# EAGLE design ai_breakout_ws2812 (EAGLE 6.5.0)
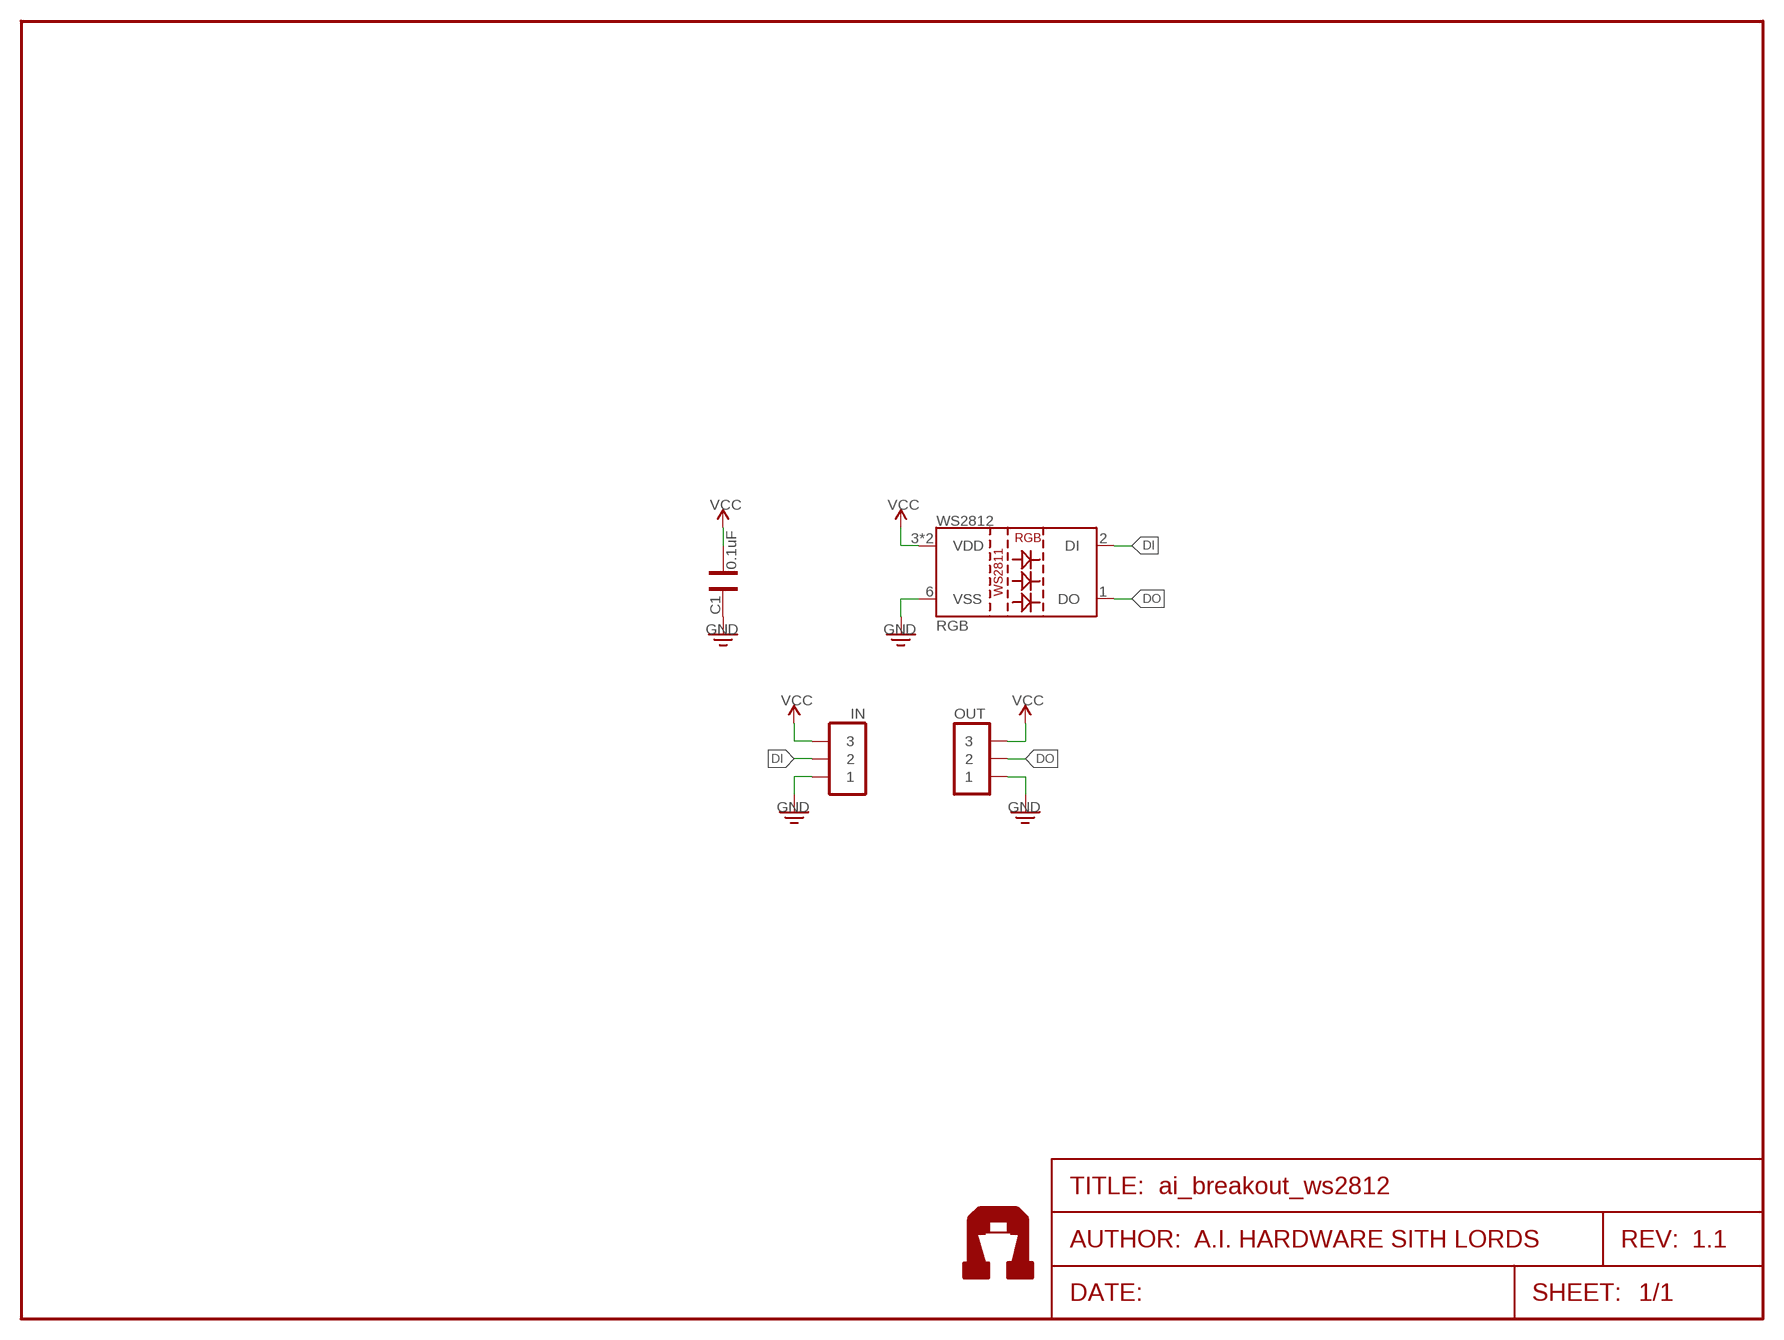
[diagram p0: schematic, sheet 1]
FRAME1 (FRAME-LETTER): AUTHOR: A.I. HARDWARE SITH LORDS; REV: 1.1

## Parts
C1  0.1uF  CAP0603  [CAP-0603]
IN  1X03  [1X03]
OUT  1X03  [1X03]
RGB  LED-WS2812  [LED-WS2812]
U$5  AI-LOGOL  [AI-LOGO-L]

## Nets
DI: IN.2 RGB.2(DI)
DO: OUT.2 RGB.1(DO)
GND: C1.2 IN.1 OUT.1 RGB.6(VSS)
VCC: C1.1 IN.3 OUT.3 RGB.3(VDD) RGB.5(VDD)

## Library data of the parts
C1 = Ai_Passives:CAP
IN OUT = Ai_Connectors:1X03
RGB = Ai_LED:LED-WS2812: WS2812 RGB LED with WS2811 driver A 5x5mm SMD LED with built-in controller IC.
U$5 = Ai_Miscellany:AI-LOGO

## Board
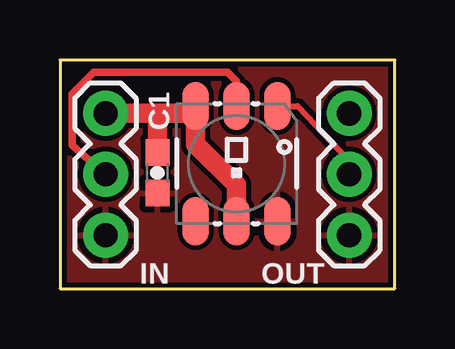
[diagram p1: board, top side]
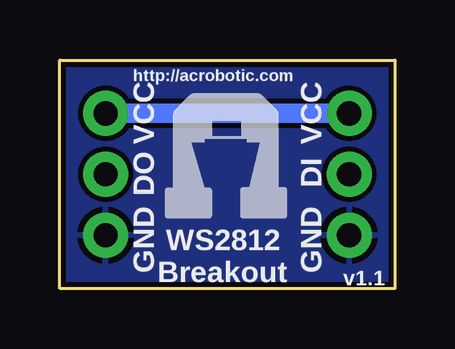
[diagram p2: board, bottom side, seen from below]

Size 13.97 x 9.53 mm. Coordinates in mm from the lower left corner, seen from the top.
Outline: 0,0 13.97,0 13.97,9.53 0,9.53 0,0
Copper layers (1*16): Top 0.035mm / dielectric 1.5mm / Bottom 0.035mm
Design rules "ai_2layer": minimum track width 7mil, minimum drill 15mil, track to track 8mil, track to pad 8mil, pad to pad 8mil, via to via 8mil, smd to smd 8mil, copper to edge 8mil, drill to drill 8mil, minimum pad ring 12mil, minimum via ring 10mil, stop-mask expansion 4mil, vias tented up to drill 20mil, thermal gap 10mil

### Footprints (pad centres in the part's own frame; a part is rotated, then mirrored left to right if it is on the bottom)
CAP-0603 = smd 1.1 x 1: 1 -0.85,0; 2 0.85,0
1X03 = drill 1.016 pad 1.88: 1 -2.54,0; 2 0,0; 3 2.54,0
LED-WS2812 = smd 2 x 1.1: 1 -2.4,1.7; 2 -2.4,0; 3 -2.4,-1.7; 4 2.4,-1.7; 5 2.4,0; 6 2.4,1.7

### Placement (x,y rotation side)
C1  4.06,4.83 270 top
IN  1.91,4.76 90 top
OUT  12.06,4.76 90 top
RGB  7.37,5.21 270 top
U$5  6.99,5.08 0 bottom

### Tracks (layer width: path | path; a pad name or v marks a point on that pad's centre or on a via)
DI
  Top 0.305: IN.2 1.52,5.08 0.51,5.97 0.51,8.13 1.4,9.02 6.99,9.02 7.37,8.64 RGB.2
DO
  Top 0.254: RGB.1 9.92,7.61 12.06,5.33 OUT.2
GND
  pour Top: 0,9.53 13.97,9.53 13.97,0 0,0
  pour Bottom: 0,9.53 13.97,9.53 13.97,0 0,0
VCC
  Top 0.813: IN.3 4.06,7.3 | 4.06,7.3 5.4,7.3 RGB.3 5.67,6.02 7.37,4.32 RGB.5 | C1.1 4.06,7.3
  Bottom 0.813: OUT.3 IN.3

### Text on the board
bPlace: VCC | VCC | http://acrobotic.com | DO | DI | GND | GND | v1.1 | WS2812 / Breakout